# Altium project MB1297.PrjPcb (part 2 of 2)

## Sheet MB1297_Arduino.SchDoc: Arduino Uno V3 connector
size A4; Date: Not used; ApprovedBy: Not used; CheckedBy: Not used; Author: Not used; CompanyName: STMicroelectronics; DrawnBy: Not used; Engineer: Not used; Organization: Not used; Address1: Not used; Address2: Not used; Address3: Not used; Address4: Not used; DocumentNumber: Not used; Revision: Not used; SheetNumber: 10; SheetTotal: 12; CurrentTime: Not used; CurrentDate: Not used; Time: Not used; DocumentFullPathAndName: Not used; DocumentName: Not used; ModifiedDate: Not used; ImagePath: Not used; ProjectName: Not used; Application_BuildNumber: Not used
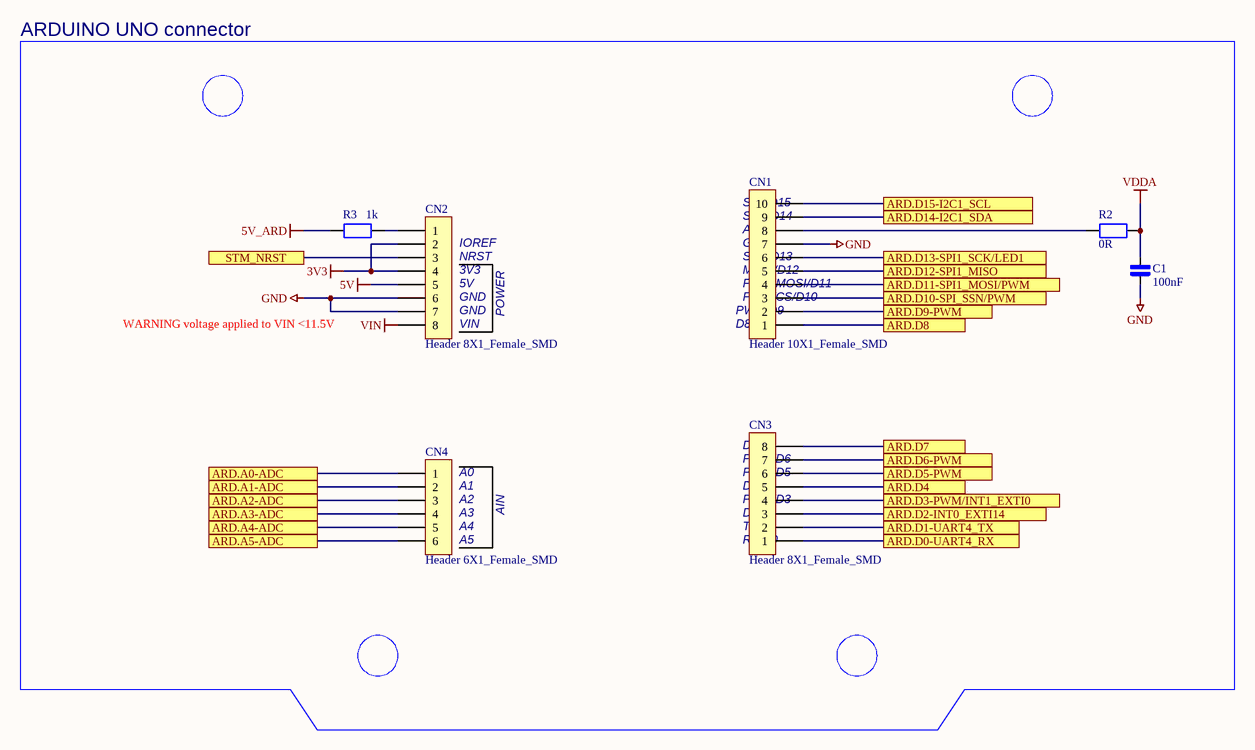
[diagram p8: MB1297_Arduino.SchDoc]

### Parts
C1  100nF  [0402]
CN1  Header 10X1_Female_SMD  [F-V50XC-1X10R-LF]
CN2  Header 8X1_Female_SMD  [F-V50XC-1X08R-LF]
CN3  Header 8X1_Female_SMD  [F-V50XC-1X08R-LF]
CN4  Header 6X1_Female_SMD  [F-V50XC-1X06R-LF]
R2  0R  [0402]
R3  1k  [0402]

### Ports
ARD.A0-ADC, ARD.A1-ADC, ARD.A2-ADC, ARD.A3-ADC, ARD.A4-ADC, ARD.A5-ADC, ARD.D0-UART4_RX, ARD.D1-UART4_TX, ARD.D2-INT0_EXTI14, ARD.D3-PWM/INT1_EXTI0, ARD.D4, ARD.D5-PWM, ARD.D6-PWM, ARD.D7, ARD.D8, ARD.D9-PWM, ARD.D10-SPI_SSN/PWM, ARD.D11-SPI1_MOSI/PWM, ARD.D12-SPI1_MISO, ARD.D13-SPI1_SCK/LED1, ARD.D14-I2C1_SDA, ARD.D15-I2C1_SCL, STM_NRST

### Nets
3V3: CN2.2 CN2.4
5V: CN2.5
5V_ARD: R3.1
GND: C1.2 CN1.7 CN2.6 CN2.7
VDDA: C1.1 R2.2
VIN: CN2.8
ARD.A0-ADC: CN4.1 ; port ARD.A0-ADC
ARD.A1-ADC: CN4.2 ; port ARD.A1-ADC
ARD.A2-ADC: CN4.3 ; port ARD.A2-ADC
ARD.A3-ADC: CN4.4 ; port ARD.A3-ADC
ARD.A4-ADC: CN4.5 ; port ARD.A4-ADC
ARD.A5-ADC: CN4.6 ; port ARD.A5-ADC
ARD.D0-UART4_RX: CN3.1 ; port ARD.D0-UART4_RX
ARD.D1-UART4_TX: CN3.2 ; port ARD.D1-UART4_TX
ARD.D2-INT0_EXTI14: CN3.3 ; port ARD.D2-INT0_EXTI14
ARD.D3-PWM/INT1_EXTI0: CN3.4 ; port ARD.D3-PWM/INT1_EXTI0
ARD.D4: CN3.5 ; port ARD.D4
ARD.D5-PWM: CN3.6 ; port ARD.D5-PWM
ARD.D6-PWM: CN3.7 ; port ARD.D6-PWM
ARD.D7: CN3.8 ; port ARD.D7
ARD.D8: CN1.1 ; port ARD.D8
ARD.D9-PWM: CN1.2 ; port ARD.D9-PWM
ARD.D10-SPI_SSN/PWM: CN1.3 ; port ARD.D10-SPI_SSN/PWM
ARD.D11-SPI1_MOSI/PWM: CN1.4 ; port ARD.D11-SPI1_MOSI/PWM
ARD.D12-SPI1_MISO: CN1.5 ; port ARD.D12-SPI1_MISO
ARD.D13-SPI1_SCK/LED1: CN1.6 ; port ARD.D13-SPI1_SCK/LED1
ARD.D14-I2C1_SDA: CN1.9 ; port ARD.D14-I2C1_SDA
ARD.D15-I2C1_SCL: CN1.10 ; port ARD.D15-I2C1_SCL
STM_NRST: CN2.3 ; port STM_NRST
NetCN1_8: CN1.8 R2.1
NetCN2_1: CN2.1 R3.2

### Notes on the sheet
- ARDUINO UNO connector
- (near CN1) SCL/D15
- (near CN2) IOREF
- (near CN2) NRST
- (near CN2) 3V3
- (near CN2) 5V
- (near CN1) SDA/D14
- (near CN1) SCK/D13
- (near CN1) MISO/D12
- (near CN1) PWM/MOSI/D11
- (near CN1) AVDD
- (near CN1) GND
- WARNING voltage applied to VIN <11.5V
- (near CN2) GND
- (near CN2) VIN
- POWER
- (near CN1) D8
- (near CN1) PWM/D9
- (near CN1) PWM/CS/D10
- (near CN4) A0
- (near CN3) PWM/D5
- (near CN3) PWM/D6
- (near CN3) D7
- (near CN4) A1
- (near CN4) A2
- (near CN4) A3
- (near CN4) A4
- (near CN4) A5
- AIN
- (near CN3) RX/D0
- (near CN3) TX/D1
- (near CN3) D2
- (near CN3) D4
- (near CN3) PWM/D3
- Title:
- Project:
- Size:
- Revision:
- Variant:
- -
- Date:
- Reference:
- Sheet:
- of

### Library data of the parts
C1 = CAP_NPOL: Capacitor_not polarized
CN1 = Header 10X1_Female_SMD: Header, 10-Pin, SMD, Single row,female; LatestRevisionDate: 17-Jul-2002; LatestRevisionNote: Re-released for DXP Platform.; Publisher: Altium Limited
CN2 CN3 = Header 8X1_Female_SMD: Header, 8-Pin, SMD, Single row,female; LatestRevisionDate: 17-Jul-2002; LatestRevisionNote: Re-released for DXP Platform.; Publisher: Altium Limited
CN4 = Header 6X1_Female_SMD: Header, 6-Pin, SMD, Single row,female; LatestRevisionDate: 17-Jul-2002; LatestRevisionNote: Re-released for DXP Platform.; Publisher: Altium Limited
R2 R3 = RES: Resistor

## Sheet MB1297_MEMS.SchDoc: MEMS Sensors
size A4; Date: Not used; ApprovedBy: Not used; CheckedBy: Not used; Author: Not used; CompanyName: STMicroelectronics; DrawnBy: Not used; Engineer: Not used; Organization: Not used; Address1: Not used; Address2: Not used; Address3: Not used; Address4: Not used; DocumentNumber: Not used; Revision: Not used; SheetNumber: 7; SheetTotal: 12; CurrentTime: Not used; CurrentDate: Not used; Time: Not used; DocumentFullPathAndName: Not used; DocumentName: Not used; ModifiedDate: Not used; ImagePath: Not used; ProjectName: Not used; Application_BuildNumber: Not used
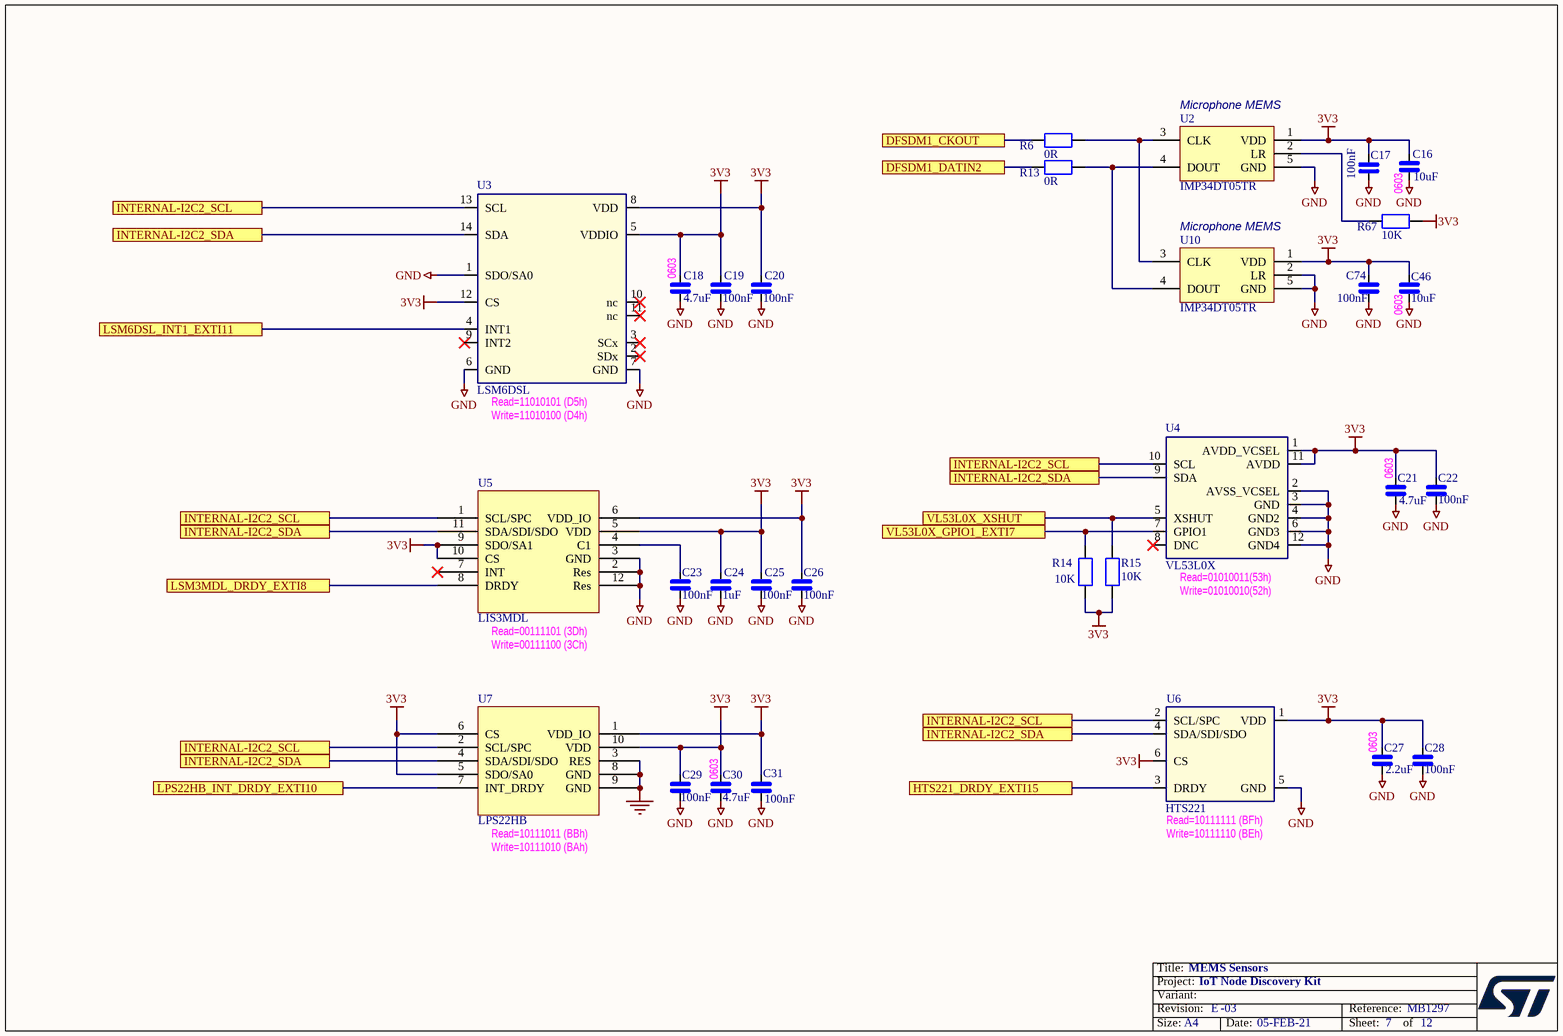
[diagram p9: MB1297_MEMS.SchDoc]

### Parts
C16  10uF  [0603_CAP_NPOL]
C17  100nF  [0402]
C18  4.7uF  [0603_CAP_NPOL]
C19  100nF  [0402]
C20  100nF  [0402]
C21  4.7uF  [0603_CAP_NPOL]
C22  100nF  [0402]
C23  100nF  [0402]
C24  1uF  [0402]
C25  100nF  [0402]
C26  100nF  [0402]
C27  2.2uF  [0603_CAP_NPOL]
C28  100nF  [0402]
C29  100nF  [0402]
C30  4.7uF  [0603_CAP_NPOL]
C31  100nF  [0402]
C46  10uF  [0603_CAP_NPOL]
C74  100nF  [0402]
R6  0R  [0402]
R13  0R  [0402]
R14  10K  [0402]
R15  10K  [0402]
R67  10K  [0402]
U2  IMP34DT05TR  [HCLGA-4LD 3x4x1]
U3  LSM6DSL  [LGA14L-2.5X3X0.86p0.5]
U4  VL53L0X  [LGA12-optical]
U5  LIS3MDL  [VFLGA12-2x2x1]
U6  HTS221  [HLGA6L-2x2x0.9]
U7  LPS22HB  [HLGA10L-2X2X0.76]
U10  IMP34DT05TR  [HCLGA-4LD 3x4x1]

### Ports
DFSDM1_CKOUT, DFSDM1_DATIN2, HTS221_DRDY_EXTI15, INTERNAL-I2C2_SCL, INTERNAL-I2C2_SDA, LPS22HB_INT_DRDY_EXTI10, LSM3MDL_DRDY_EXTI8, LSM6DSL_INT1_EXTI11, VL53L0X_GPIO1_EXTI7, VL53L0X_XSHUT

### Nets
3V3: C16.1 C17.2 C18.1 C19.1 C20.1 C21.1 C22.1 C24.1 C25.1 C26.1 C27.1 C28.1 C29.1 C30.1 C31.1 C46.1 C74.1 R14.1 R15.1 R67.1 U2.1(VDD) U3.5(VDDIO) U3.8(VDD) U3.12(CS) U4.1(AVDD_VCSEL) U4.11(AVDD) U5.5(VDD) U5.6(VDD_IO) U5.9(SDO/SA1) U5.10(CS) U6.1(VDD) U6.6(CS) U7.1(VDD_IO) U7.5(SDO/SA0) U7.6(CS) U7.10(VDD) U10.1(VDD)
GND: C16.2 C17.1 C18.2 C19.2 C20.2 C21.2 C22.2 C23.2 C24.2 C25.2 C26.2 C27.2 C28.2 C29.2 C30.2 C31.2 C46.2 C74.2 U2.5(GND) U3.1(SDO/SA0) U3.6(GND) U3.7(GND) U4.2(AVSS_VCSEL) U4.3(GND) U4.4(GND2) U4.6(GND3) U4.12(GND4) U5.2(Res) U5.3(GND) U5.12(Res) U6.5(GND) U7.3(RES) U7.8(GND) U7.9(GND) U10.2(LR) U10.5(GND)
DFSDM1_CKOUT: R6.2 ; port DFSDM1_CKOUT
DFSDM1_DATIN2: R13.2 ; port DFSDM1_DATIN2
HTS221_DRDY_EXTI15: U6.3(DRDY) ; port HTS221_DRDY_EXTI15
INTERNAL-I2C2_SCL: U3.13(SCL) U4.10(SCL) U5.1(SCL/SPC) U6.2(SCL/SPC) U7.2(SCL/SPC) ; port INTERNAL-I2C2_SCL
INTERNAL-I2C2_SDA: U3.14(SDA) U4.9(SDA) U5.11(SDA/SDI/SDO) U6.4(SDA/SDI/SDO) U7.4(SDA/SDI/SDO) ; port INTERNAL-I2C2_SDA
LPS22HB_INT_DRDY_EXTI10: U7.7(INT_DRDY) ; port LPS22HB_INT_DRDY_EXTI10
LSM3MDL_DRDY_EXTI8: U5.8(DRDY) ; port LSM3MDL_DRDY_EXTI8
LSM6DSL_INT1_EXTI11: U3.4(INT1) ; port LSM6DSL_INT1_EXTI11
VL53L0X_GPIO1_EXTI7: R14.2 U4.7(GPIO1) ; port VL53L0X_GPIO1_EXTI7
VL53L0X_XSHUT: R15.2 U4.5(XSHUT) ; port VL53L0X_XSHUT
NetC23_1: C23.1 U5.4(C1)
NetR6_1: R6.1 U2.3(CLK) U10.3(CLK)
NetR13_1: R13.1 U2.4(DOUT) U10.4(DOUT)
NetR67_2: R67.2 U2.2(LR)

Not connected (* = marked no-connect by the designer): U3 2(SDx)* 3(SCx)* 9(INT2)* 10(nc)* 11(nc)*; U4 8(DNC)*; U5 7(INT)*

### Notes on the sheet
- (near U2) Microphone MEMS
- (near U10) Microphone MEMS
- (near C16) 0603
- (near C18) 0603
- (near C46) 0603
- (near U3) Read=11010101 (D5h)
- (near U3) Write=11010100 (D4h)
- (near C21) 0603
- (near U4) Read=01010011(53h)
- (near U5) Read=00111101 (3Dh)
- Write=00111100 (3Ch)
- (near U4) Write=01010010(52h)
- (near C30) 0603
- (near C27) 0603
- (near U7) Read=10111011 (BBh)
- Write=10111010 (BAh)
- (near U6) Read=10111111 (BFh)
- (near U6) Write=10111110 (BEh)
- Title:
- Project:
- Size:
- Revision:
- Variant:
- A4
- -
- Date:
- Reference:
- Sheet:
- of

### Library data of the parts
C16-C31 C46 C74 = CAP_NPOL: Capacitor_not polarized
R6 R13-R15 R67 = RES: Resistor
U2 U10 = MP34DT01: MEMS audio microphone
U3 = LSM6DSL: Accelero + Gyro MEMS (6 Axis)
U4 = VL53L0X: Proximity sensor MEMS
U5 = LIS3MDL: IC,Sensor; Provider: MMCC; Vendor: ST; AsmInst: *; Category: IC; PartNumber: *
U6 = HTS221: Humidity + Temp MEMS
U7 = LPS22HB: IC,Sensor; Provider: MMCC; Vendor: ST; AsmInst: *; Category: IC; PartNumber: *

## Sheet MB1297_USB_OTG_FS.SchDoc: USB OTG FS
size A4; Date: Not used; ApprovedBy: Not used; CheckedBy: Not used; Author: Not used; CompanyName: STMicroelectronics; DrawnBy: Not used; Engineer: Not used; Organization: Not used; Address1: Not used; Address2: Not used; Address3: Not used; Address4: Not used; DocumentNumber: Not used; Revision: Not used; SheetNumber: 5; SheetTotal: 12; CurrentTime: Not used; CurrentDate: Not used; Time: Not used; DocumentFullPathAndName: Not used; DocumentName: Not used; ModifiedDate: Not used; ImagePath: Not used; ProjectName: Not used; Application_BuildNumber: Not used
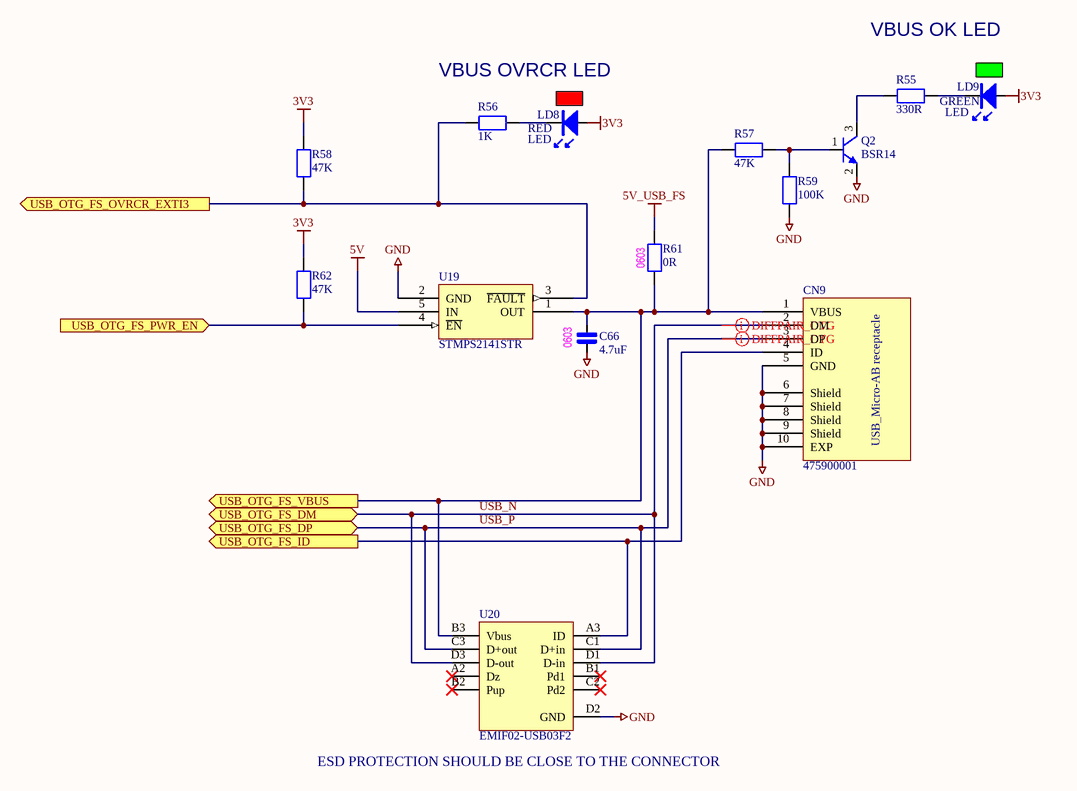
[diagram p10: MB1297_USB_OTG_FS.SchDoc]

### Parts
C66  4.7uF  [0603_CAP_NPOL]
CN9  475900001  [CON_USBMICROAB_MOLEX_47590-0001_H3]
LD8  LED  Color: RED  [0603_LED_RED]
LD9  LED  Color: GREEN  [0603_LED_GREEN]
Q2  BSR14  [SOT23-3]
R55  330R  [0402]
R56  1K  [0402]
R57  47K  [0402]
R58  47K  [0402]
R59  100K  [0402]
R61  0R  [0603_RES]
R62  47K  [0402]
U19  STMPS2141STR  [MOS_SOT23-5L]
U20  EMIF02-USB03F2  [ESD_FLIP-CHIP-BGA11_1P44X1P94_P050]

### Ports
USB_OTG_FS_DM (bidir), USB_OTG_FS_DP (bidir), USB_OTG_FS_ID (out), USB_OTG_FS_OVRCR_EXTI3 (out), USB_OTG_FS_PWR_EN (in), USB_OTG_FS_VBUS (out)

### Nets
3V3: LD8.A LD9.A R58.1 R62.1
5V: U19.5(IN)
5V_USB_FS: R61.1
GND: C66.2 CN9.5(GND) CN9.6(Shield) CN9.7(Shield) CN9.8(Shield) CN9.9(Shield) CN9.10(EXP) Q2.2(E) R59.1 U19.2(GND) U20.D2(GND)
USB_N: CN9.2(DM) U20.D1(D-in) U20.D3(D-out) ; port USB_OTG_FS_DM
USB_OTG_FS_ID: CN9.4(ID) U20.A3(ID) ; port USB_OTG_FS_ID
USB_OTG_FS_OVRCR_EXTI3: R56.1 R58.2 U19.3(~{FAULT}) ; port USB_OTG_FS_OVRCR_EXTI3
USB_OTG_FS_PWR_EN: R62.2 U19.4(~{EN}) ; port USB_OTG_FS_PWR_EN
USB_OTG_FS_VBUS: C66.1 CN9.1(VBUS) R57.1 R61.2 U19.1(OUT) U20.B3(Vbus) ; port USB_OTG_FS_VBUS
USB_P: CN9.3(DP) U20.C1(D+in) U20.C3(D+out) ; port USB_OTG_FS_DP
NetLD8_K: LD8.K R56.2
NetLD9_K: LD9.K R55.2
NetQ2_1: Q2.1(B) R57.2 R59.2
NetQ2_3: Q2.3(C) R55.1

Not connected (* = marked no-connect by the designer): U20 A2(Dz)* B1(Pd1)* B2(Pup)* C2(Pd2)*

### Layout directives
differential pair: USB_N, USB_P

### Notes on the sheet
- VBUS OVRCR LED
- VBUS OK LED
- (near R61) 0603
- (near C66) 0603
- (near U20) ESD PROTECTION SHOULD BE CLOSE TO THE CONNECTOR
- Title:
- Project:
- Size:
- Revision:
- Variant:
- A4
- -
- Date:
- Reference:
- Sheet:
- of
- (in symbol 475900001) USB_Micro-AB receptacle

### Library data of the parts
C66 = CAP_NPOL: Capacitor_not polarized
CN9 = 475900001: USB-MICRO-AB, 47590-0001, SMT, MOLEX; Fitted: YES; Ordered_By: Subcon; Manuf_Part_1: 47590-0001; Manuf_1: MOLEX; ECCN_US/EU: n/a; Distrib: *; Value: 475900001; Order_Code: *
LD8 LD9 = LED: Light-Emitting Diode; Part Number A: *
Q2 = BSR14: BSR14 NPN switching transistor SOT23 (Marking U8)
R55-R59 R61 R62 = RES: Resistor
U19 = STMPS2141STR: Enhanced single channel power switches; Manuf_1: STM; ECCN_US/EU: EAR99/NEC; Ref St: 9159003; Fitted: YES; Manuf_Part_1: STMPS2141STR; Distrib: STM; Ordered_By: STM; Order_Code: STMPS2141STR; Value: STMPS2141STR
U20 = EMIF02-USB03F2: 2-line IPAD, EMI filter including ESD protection; Manuf_1: STM; ECCN_US/EU: EAR99/NEC; Fitted: YES; REF_STM: 9179037; Manuf_Part_1: EMIF02-USB03F2; Distrib: ST; Order_code: EMIF02-USB03F2; Ordered_By: STM; Value: EMIF02-USB03F2

## Sheet MB1297_POWER.SchDoc: Power supply
size A4; Date: Not used; ApprovedBy: Not used; CheckedBy: Not used; Author: Not used; CompanyName: STMicroelectronics; DrawnBy: Not used; Engineer: Not used; Organization: Not used; Address1: Not used; Address2: Not used; Address3: Not used; Address4: Not used; DocumentNumber: Not used; Revision: Not used; SheetNumber: 9; SheetTotal: 12; CurrentTime: Not used; CurrentDate: Not used; Time: Not used; DocumentFullPathAndName: Not used; DocumentName: Not used; ModifiedDate: Not used; ImagePath: Not used; ProjectName: Not used; Application_BuildNumber: Not used
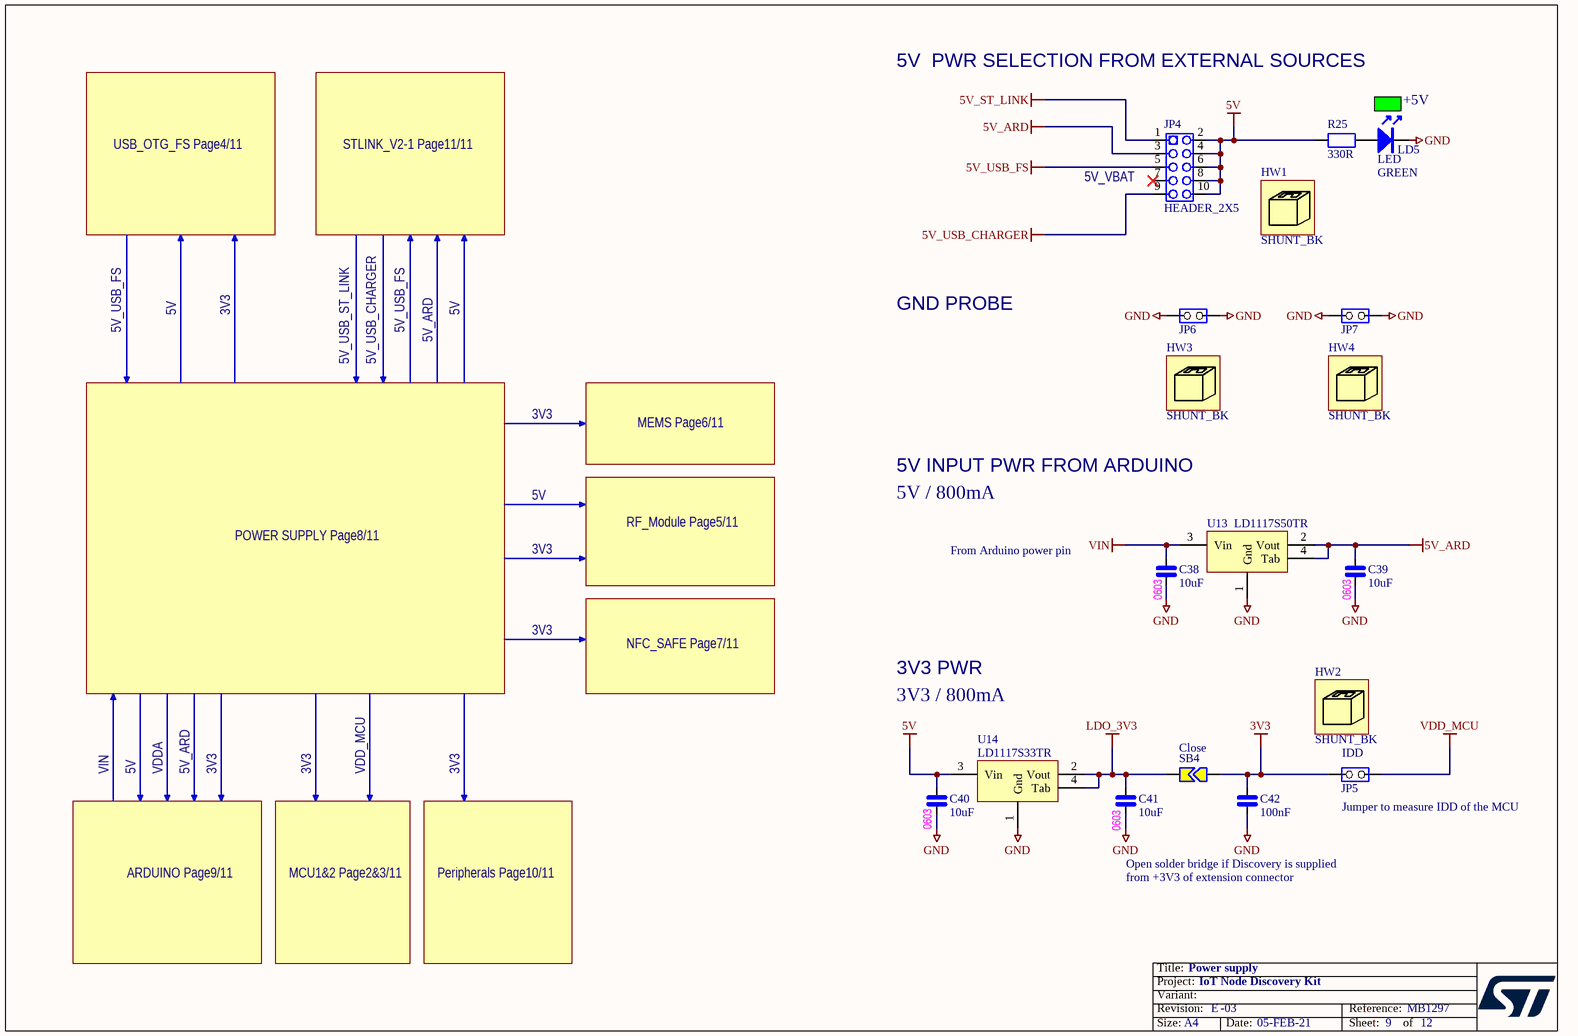
[diagram p11: MB1297_POWER.SchDoc]

### Parts
C38  10uF  [0603_CAP_NPOL]
C39  10uF  [0603_CAP_NPOL]
C40  10uF  [0603_CAP_NPOL]
C41  10uF  [0603_CAP_NPOL]
C42  100nF  [0402]
HW1  SHUNT_BK  (mechanical)
HW2  SHUNT_BK  (mechanical)
HW3  SHUNT_BK  (mechanical)
HW4  SHUNT_BK  (mechanical)
JP4  HEADER_2X5  [Header M 2x5x2.54 TH V]
JP5  Jumper_2.54mm  [CON_SAMTEC_TSW-102-07-G-S]  (value not drawn)
JP6  Jumper_2.54mm  [CON_SAMTEC_TSW-102-07-G-S]  (value not drawn)
JP7  Jumper_2.54mm  [CON_SAMTEC_TSW-102-07-G-S]  (value not drawn)
LD5  LED  Color: GREEN  [0603_LED_GREEN]
R25  330R  [0402]
SB4  Close  [SB]
U13  LD1117S50TR  [REG_SOT223-TAB]
U14  LD1117S33TR  [REG_SOT223-TAB]

### Nets
3V3: C42.1 JP5.1(COMMON) SB4.2
5V: C40.1 JP4.2 JP4.4 JP4.6 JP4.8 JP4.10 R25.1 U14.3(Vin)
5V_ARD: C39.1 JP4.3 U13.2(Vout) U13.4(Tab)
5V_ST_LINK: JP4.1
5V_USB_CHARGER: JP4.9
5V_USB_FS: JP4.5
GND: C38.2 C39.2 C40.2 C41.2 C42.2 JP6.1(COMMON) JP6.2(NO) JP7.1(COMMON) JP7.2(NO) LD5.K U13.1(Gnd) U14.1(Gnd)
LDO_3V3: C41.1 SB4.1 U14.2(Vout) U14.4(Tab)
VDD_MCU: JP5.2(NO)
VIN: C38.1 U13.3(Vin)
NetLD5_A: LD5.A R25.2

Not connected (* = marked no-connect by the designer): JP4 7*

### Notes on the sheet
- 5V  PWR SELECTION FROM EXTERNAL SOURCES
- (near LD5) +5V
- USB_OTG_FS Page4/11
- STLINK_V2-1 Page11/11
- (near JP4) 5V_VBAT
- 5V
- 3V3
- GND PROBE
- 5V_USB_FS
- 5V_USB_ST_LINK
- 5V_USB_CHARGER
- 5V_ARD
- MEMS Page6/11
- 5V / 800mA
- 5V INPUT PWR FROM ARDUINO
- POWER SUPPLY Page8/11
- RF_Module Page5/11
- From Arduino power pin
- NFC_SAFE Page7/11
- (near C38) 0603
- (near C39) 0603
- 3V3 / 800mA
- 3V3 PWR
- VIN
- VDDA
- VDD_MCU
- (near JP5) IDD
- (near C40) 0603
- (near C41) 0603
- (near JP5) Jumper to measure IDD of the MCU
- ARDUINO Page9/11
- MCU1&2 Page2&3/11
- Peripherals Page10/11
- Open solder bridge if Discovery is supplied
  from +3V3 of extension connector
- Title:
- Project:
- Size:
- Revision:
- Variant:
- A4
- -
- Date:
- Reference:
- Sheet:
- of

### Library data of the parts
C38-C42 = CAP_NPOL: Capacitor_not polarized
HW1-HW4 = Shunt 2.54mm: SHUNT 2.54mm BLACK; Manuf_1: SAMTEC; Manuf_Part_1: SNT-100-BK-G; Fitted: Manually; Ordered_By: Subcon; ECCN_US/EU: n/a; Distrib: *; Order_Code: *; Value: SHUNT_BK
JP5-JP7 = TSW-102-07-x-S: Connector jumper 1 position; Manuf_1: SAMTEC; Manuf_Part_2: 4711955140470; Manuf_2: KONTEC; Order_Code: 423-2841; Fitted: YES; Ordered_By: Subcon; ECCN_US/EU: n/a; Value: Jumper_2.54mm; Manuf_Part_1: TSW-102-07-x-S
LD5 = LED: Light-Emitting Diode; Part Number A: *
R25 = RES: Resistor
SB4 = Strap2: Solder Jumper; Solder: YES; Published: 24-Mar-1999; Revision: July-2002: Re-released for DXP Platform.; Publisher: Altium Limited
U13 = LD1117S50TR: IC REG LDO 5V 0.8A SOT223; Manuf_1: STM; ECCN_US/EU: EAR99/NEC; Ref St: 9176133; Fitted: YES; Manuf_Part_1: LD1117S50TR; Distrib: STM; Ordered_By: STM; Order_code: LD1117S50TR; Value: LD1117S50TR
U14 = LD1117S33TR: LOW DROP FIXED AND ADJUSTABLE POSITIVE VOLTAGE REGULATORS (3.3 Volts); Manuf_1: STM; ECCN_US/EU: EAR99/NEC; Fitted: YES; Manuf_Part_1: LD1117S33TR; Distrib: STM; Order_Code: LD1117S33TR; Ordered_By: STM; Value: LD1117S33TR

## Nets that join several sheets
3V3: MB1297_MCU1 (R8.1 R9.1 R10.1 R11.1), MB1297_RF_Module (7 pins), MB1297_Peripherals (6 pins), MB1297_NFC_SAFE (C33.1 L2.2 R4.1 U9.2), MB1297_Arduino (CN2.2 CN2.4), MB1297_MEMS (37 pins), MB1297_USB_OTG_FS (LD8.A LD9.A R58.1 R62.1), MB1297_POWER (C42.1 JP5.1 SB4.2)
5V: MB1297_RF_Module (C49.1 U12.1), MB1297_STLINK_V2-1 (D2.1), MB1297_Arduino (CN2.5), MB1297_USB_OTG_FS (U19.5), MB1297_POWER (8 pins)
5V_ARD: MB1297_STLINK_V2-1 (D3.1), MB1297_Arduino (R3.1), MB1297_POWER (C39.1 JP4.3 U13.2 U13.4)
5V_ST_LINK: MB1297_STLINK_V2-1 (C65.1 SB11.1 U17.6 U17.7), MB1297_POWER (JP4.1)
5V_USB_CHARGER: MB1297_STLINK_V2-1 (11 pins), MB1297_POWER (JP4.9)
5V_USB_FS: MB1297_STLINK_V2-1 (D5.1), MB1297_USB_OTG_FS (R61.1), MB1297_POWER (JP4.5)
GND: MB1297_MCU1 (C14.2 C15.2), MB1297_MCU2 (20 pins), MB1297_RF_Module (29 pins), MB1297_Peripherals (14 pins), MB1297_NFC_SAFE (11 pins), MB1297_STLINK_V2-1 (42 pins), MB1297_Arduino (C1.2 CN1.7 CN2.6 CN2.7), MB1297_MEMS (36 pins), MB1297_USB_OTG_FS (11 pins), MB1297_POWER (12 pins)
VDD_MCU: MB1297_MCU2 (15 pins), MB1297_POWER (JP5.2)
VDDA: MB1297_MCU2 (5 pins), MB1297_Arduino (C1.1 R2.2)
VIN: MB1297_Arduino (CN2.8), MB1297_POWER (C38.1 U13.3)
ARD.A0-ADC: MB1297_MCU1 (U1.34), MB1297_Arduino (CN4.1)
ARD.A1-ADC: MB1297_MCU1 (U1.33), MB1297_Arduino (CN4.2)
ARD.A2-ADC: MB1297_MCU1 (U1.18), MB1297_Arduino (CN4.3)
ARD.A3-ADC: MB1297_MCU1 (U1.17), MB1297_Arduino (CN4.4)
ARD.A4-ADC: MB1297_MCU1 (U1.16), MB1297_Arduino (CN4.5)
ARD.A5-ADC: MB1297_MCU1 (U1.15), MB1297_Arduino (CN4.6)
ARD.D0-UART4_RX: MB1297_MCU1 (U1.24), MB1297_Arduino (CN3.1)
ARD.D1-UART4_TX: MB1297_MCU1 (U1.23), MB1297_Arduino (CN3.2)
ARD.D2-INT0_EXTI14: MB1297_MCU1 (U1.61), MB1297_Arduino (CN3.3)
ARD.D3-PWM/INT1_EXTI0: MB1297_MCU1 (U1.35), MB1297_Arduino (CN3.4)
ARD.D4: MB1297_MCU1 (U1.26), MB1297_Arduino (CN3.5)
ARD.D5-PWM: MB1297_MCU1 (U1.90), MB1297_Arduino (CN3.6)
ARD.D6-PWM: MB1297_MCU1 (U1.36), MB1297_Arduino (CN3.7)
ARD.D7: MB1297_MCU1 (U1.29), MB1297_Arduino (CN3.8)
ARD.D8: MB1297_MCU1 (U1.37), MB1297_Arduino (CN1.1)
ARD.D9-PWM: MB1297_MCU1 (U1.77), MB1297_Arduino (CN1.2)
ARD.D10-SPI_SSN/PWM: MB1297_MCU1 (U1.25), MB1297_Arduino (CN1.3)
ARD.D11-SPI1_MOSI/PWM: MB1297_MCU1 (U1.32), MB1297_Arduino (CN1.4)
ARD.D12-SPI1_MISO: MB1297_MCU1 (U1.31), MB1297_Arduino (CN1.5)
ARD.D13-SPI1_SCK/LED1: MB1297_MCU1 (U1.30), MB1297_Peripherals (SB1.1), MB1297_Arduino (CN1.6)
ARD.D14-I2C1_SDA: MB1297_MCU1 (R8.2 U1.96), MB1297_Arduino (CN1.9)
ARD.D15-I2C1_SCL: MB1297_MCU1 (R9.2 U1.95), MB1297_Arduino (CN1.10)
BUTTON_EXTI13: MB1297_MCU1 (U1.7), MB1297_Peripherals (SB3.1)
DFSDM1_CKOUT: MB1297_MCU1 (U1.40), MB1297_MEMS (R6.2)
DFSDM1_DATIN2: MB1297_MCU1 (U1.38), MB1297_MEMS (R13.2)
HTS221_DRDY_EXTI15: MB1297_MCU1 (U1.62), MB1297_MEMS (U6.3)
INTERNAL-I2C2_SCL: MB1297_MCU1 (R10.2 U1.47), MB1297_NFC_SAFE (U8.6 U9.7), MB1297_MEMS (5 pins)
INTERNAL-I2C2_SDA: MB1297_MCU1 (R11.2 U1.48), MB1297_NFC_SAFE (U8.5 U9.5), MB1297_MEMS (5 pins)
INTERNAL-SPI3_MISO: MB1297_MCU1 (U1.79), MB1297_RF_Module (M1.8 M2.10 M3.8)
INTERNAL-SPI3_MOSI: MB1297_MCU1 (U1.80), MB1297_RF_Module (M1.9 M2.9 M3.9)
INTERNAL-SPI3_SCK: MB1297_MCU1 (U1.78), MB1297_RF_Module (M1.7 M2.11 M3.7)
INTERNAL-UART3_RX: MB1297_MCU1 (U1.56), MB1297_RF_Module (M2.22)
INTERNAL-UART3_TX: MB1297_MCU1 (U1.55), MB1297_RF_Module (M2.21)
ISM43362-BOOT0: MB1297_MCU1 (U1.51), MB1297_RF_Module (M2.33)
ISM43362-DRDY_EXTI1: MB1297_MCU1 (U1.98), MB1297_RF_Module (M2.13)
ISM43362-RST: MB1297_MCU1 (U1.39), MB1297_RF_Module (M2.34)
ISM43362-SPI3_CSN: MB1297_MCU1 (U1.97), MB1297_RF_Module (M2.12 R26.1)
ISM43362-WAKEUP: MB1297_MCU1 (U1.52), MB1297_RF_Module (M2.16)
LED2: MB1297_MCU1 (U1.53), MB1297_Peripherals (R20.1)
LED3(WIFI) & LED4(BLE): MB1297_MCU1 (U1.66), MB1297_Peripherals (R21.1 R22.1)
LPS22HB_INT_DRDY_EXTI10: MB1297_MCU1 (U1.57), MB1297_MEMS (U7.7)
LSM3MDL_DRDY_EXTI8: MB1297_MCU1 (U1.65), MB1297_MEMS (U5.8)
LSM6DSL_INT1_EXTI11: MB1297_MCU1 (U1.58), MB1297_MEMS (U3.4)
PMOD-IRQ_EXTI2: MB1297_MCU1 (U1.83), MB1297_Peripherals (CN10.7)
PMOD-RESET: MB1297_MCU1 (U1.81), MB1297_Peripherals (CN10.8)
PMOD-SPI2_SCK: MB1297_MCU1 (U1.82), MB1297_Peripherals (SB21.1)
PMOD-UART2_CTS/SPI2_MISO: MB1297_MCU1 (U1.84), MB1297_Peripherals (SB18.2 SB19.2)
PMOD-UART2_RTS/SPI2_MOSI: MB1297_MCU1 (U1.85), MB1297_Peripherals (SB15.2 SB16.2)
PMOD-UART2_RX: MB1297_MCU1 (U1.87), MB1297_Peripherals (SB20.1)
PMOD-UART2_TX/SPI2_CSN: MB1297_MCU1 (U1.86), MB1297_Peripherals (SB12.2 SB14.2)
QUADSPI_BK1_IO0: MB1297_MCU1 (U1.43), MB1297_RF_Module (U11.5)
QUADSPI_BK1_IO1: MB1297_MCU1 (U1.44), MB1297_RF_Module (U11.2)
QUADSPI_BK1_IO2: MB1297_MCU1 (U1.45), MB1297_RF_Module (U11.3)
QUADSPI_BK1_IO3: MB1297_MCU1 (U1.46), MB1297_RF_Module (U11.7)
QUADSPI_CLK: MB1297_MCU1 (U1.41), MB1297_RF_Module (U11.6)
QUADSPI_NCS: MB1297_MCU1 (U1.42), MB1297_RF_Module (U11.1)
SPBTLE-RF-IRQ_EXTI6: MB1297_MCU1 (U1.5), MB1297_RF_Module (M1.4)
SPBTLE-RF-RST: MB1297_MCU1 (U1.67), MB1297_RF_Module (M1.11)
SPBTLE-RF-SPI3_CSN: MB1297_MCU1 (U1.60), MB1297_RF_Module (M1.10)
SPSGRF-915-GPIO3_EXTI5: MB1297_MCU1 (U1.4), MB1297_RF_Module (M3.1)
SPSGRF-915-SDN: MB1297_MCU1 (U1.54), MB1297_RF_Module (M3.11)
SPSGRF-915-SPI3_CSN: MB1297_MCU1 (U1.91), MB1297_RF_Module (M3.10)
ST25DV04K-GPO: MB1297_MCU1 (U1.3), MB1297_NFC_SAFE (R4.2 U8.7)
ST25DV04K-RF_DISABLE: MB1297_MCU1 (U1.1), MB1297_NFC_SAFE (R1.2 U8.1)
ST-LINK-UART1_RX: MB1297_MCU1 (U1.93), MB1297_STLINK_V2-1 (R42.2)
ST-LINK-UART1_TX: MB1297_MCU1 (U1.92), MB1297_STLINK_V2-1 (R43.2)
STM_NRST: MB1297_MCU2 (C3.2 U1.14), MB1297_Peripherals (SB2.1), MB1297_STLINK_V2-1 (R34.2 SB8.1), MB1297_Arduino (CN2.3)
STSAFE-A110-RESET: MB1297_MCU1 (U1.88), MB1297_NFC_SAFE (U9.1)
SYS_JTCK-SWCLK: MB1297_MCU1 (U1.76), MB1297_STLINK_V2-1 (R32.2 SB6.1)
SYS_JTDO-SWO: MB1297_MCU1 (U1.89), MB1297_STLINK_V2-1 (R35.2 SB7.1)
SYS_JTMS-SWDIO: MB1297_MCU1 (U1.72), MB1297_STLINK_V2-1 (R33.2 SB5.1)
USB_N: MB1297_MCU1 (U1.70), MB1297_USB_OTG_FS (CN9.2 U20.D1 U20.D3)
USB_OTG_FS_ID: MB1297_MCU1 (U1.69), MB1297_USB_OTG_FS (CN9.4 U20.A3)
USB_OTG_FS_OVRCR_EXTI3: MB1297_MCU1 (U1.2), MB1297_USB_OTG_FS (R56.1 R58.2 U19.3)
USB_OTG_FS_PWR_EN: MB1297_MCU1 (U1.59), MB1297_USB_OTG_FS (R62.2 U19.4)
USB_OTG_FS_VBUS: MB1297_MCU1 (U1.68), MB1297_USB_OTG_FS (6 pins)
USB_P: MB1297_MCU1 (U1.71), MB1297_USB_OTG_FS (CN9.3 U20.C1 U20.C3)
VL53L0X_GPIO1_EXTI7: MB1297_MCU1 (U1.64), MB1297_MEMS (R14.2 U4.7)
VL53L0X_XSHUT: MB1297_MCU1 (U1.63), MB1297_MEMS (R15.2 U4.5)

## Assembly variants
L4S5VI: not fitted C2 C4 C69 C70 C72 CN5 CN6 CN8 M3 R5 R7 R30 R36 R64 R65 R66 SB9 SB11 SB12 SB16 SB19 SB20 X1
L475VG-915: all parts fitted
L475VG-868: all parts fitted